# Altium schematic sheet RedBoard.SchDoc: Redboard Uno Clone
size B; Date: 1/7/2019 11:11:43 AM; Engineer: G. Lansberry; Organization: Wyss Institute at Harvard; Address1: 3 Blackfan Circle; Address2: Boston, MA 02115; Address3: USA; DocumentNumber: N/A; Revision: A; SheetNumber: 1; SheetTotal: 1
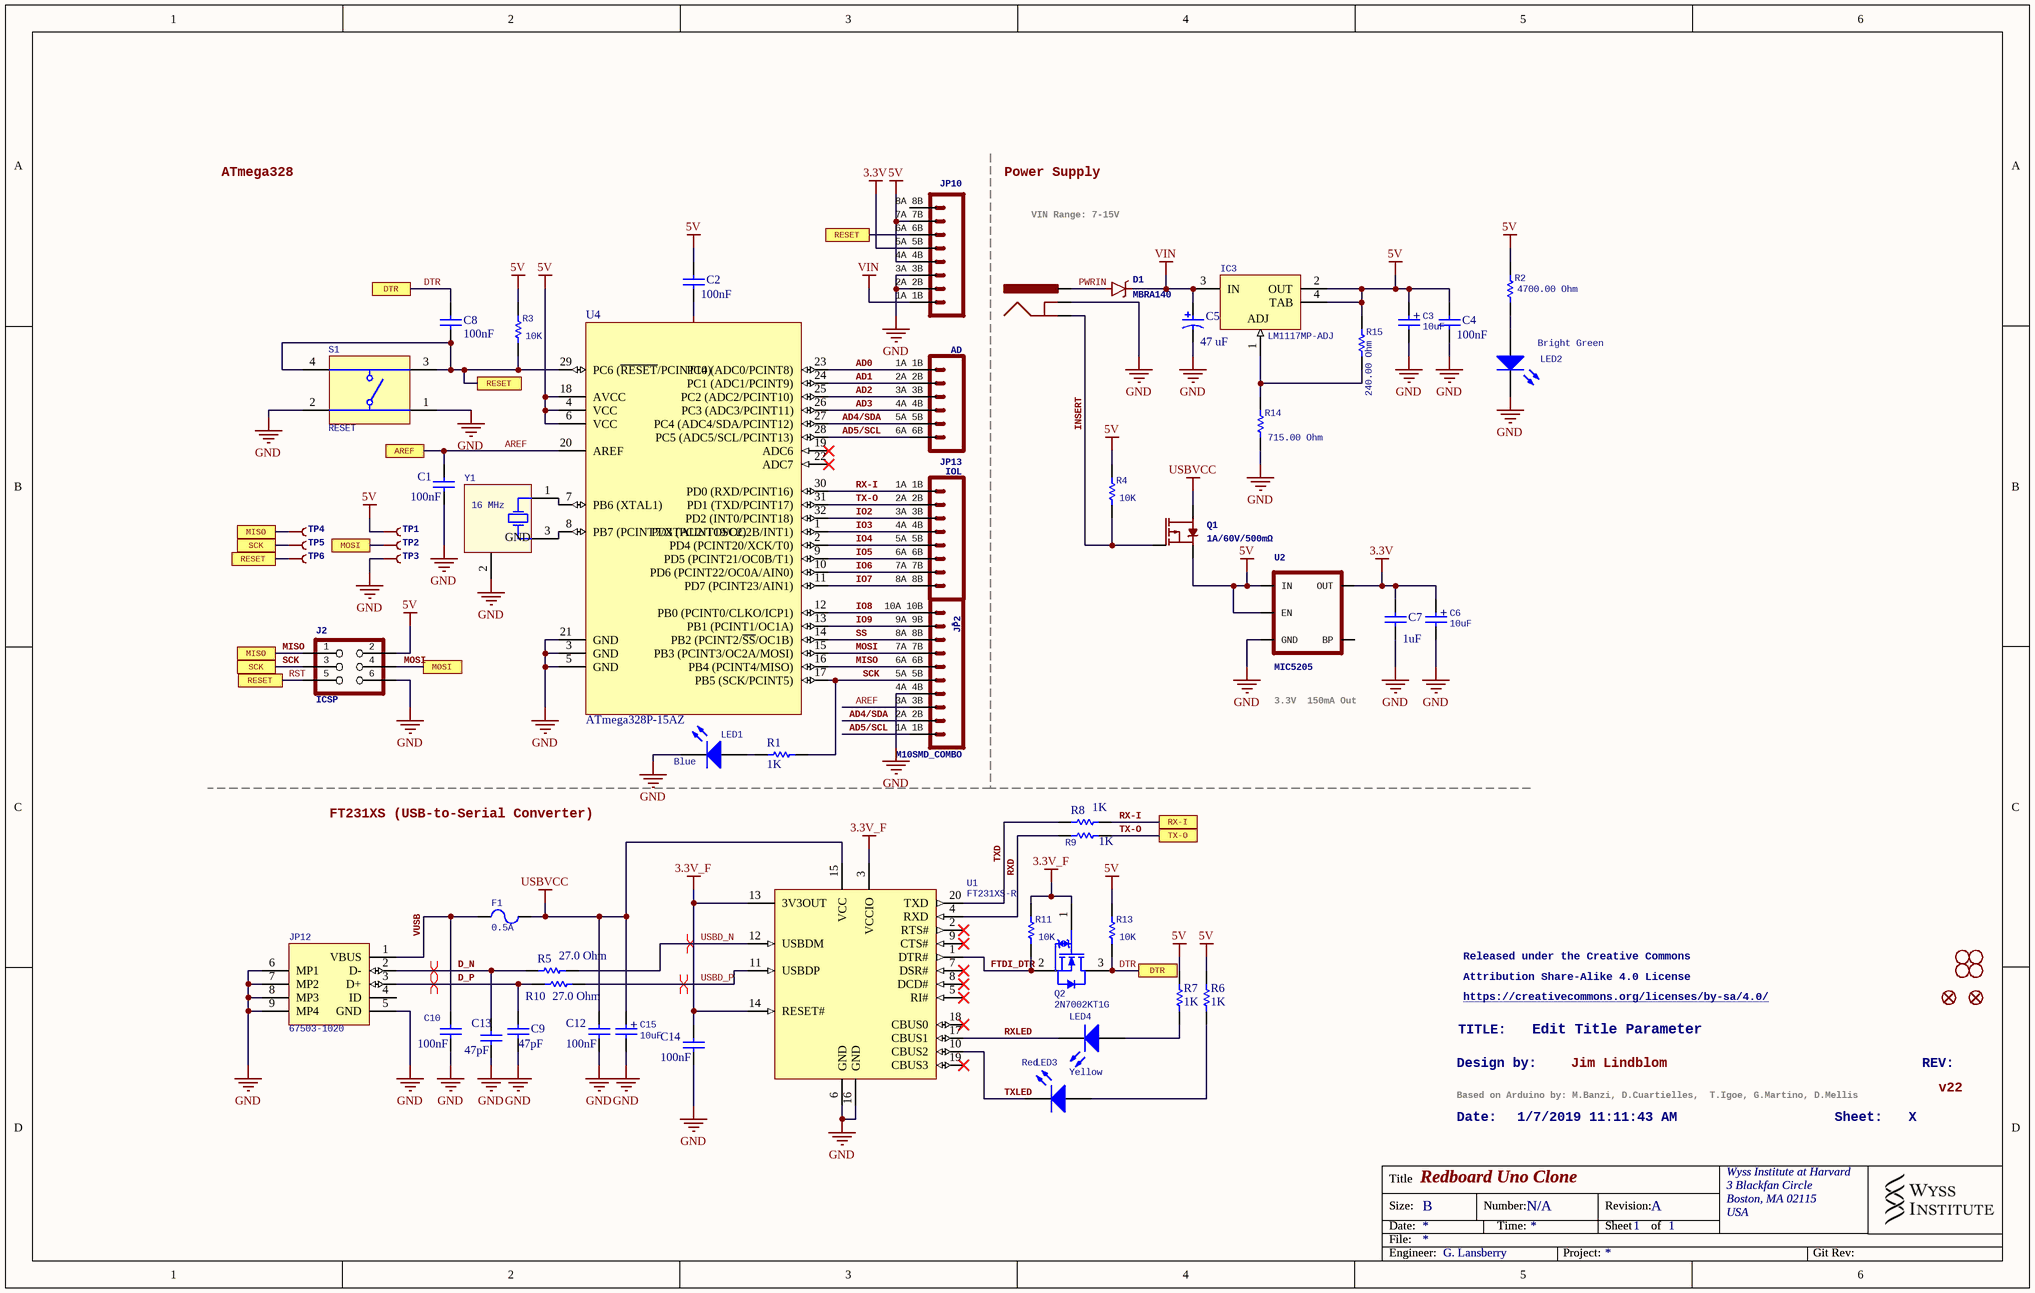
[diagram p0: RedBoard.SchDoc]

## Parts
C1  value 100nF  [CAPC0402(1005)60_M]  (hidden comment: CAP 100nF 10V 0402(1005))
C2  value 100nF  [CAPC0402(1005)60_M]  (hidden comment: CAP 100nF 10V 0402(1005))
C3  value 10uF  [CAPC2113X120X50NL20T30X]  (hidden comment: TAJP106M010RNJ)
C4  value 100nF  [CAPC0402(1005)60_M]  (hidden comment: CAP 100nF 10V 0402(1005))
C5  Cap.: 47 uF  [PNSC-FT-V-53x53-2_V]  (hidden comment: EEE-FT1E470AR)
C6  value 10uF  [CAPC2113X120X50NL20T30X]  (hidden comment: TAJP106M010RNJ)
C7  value 1uF  [CAPC0402(1005)60_N]  (hidden comment: CAP 1uF 10V 0402(1005))
C8  value 100nF  [CAPC0402(1005)60_M]  (hidden comment: CAP 100nF 10V 0402(1005))
C9  value 47pF  [CAPC0402(1005)60_M]  (hidden comment: CAP 47pF 10V 0402(1005))
C10  value 100nF  [CAPC0402(1005)60_M]  (hidden comment: CAP 100nF 10V 0402(1005))
C12  value 100nF  [CAPC0402(1005)60_M]  (hidden comment: CAP 100nF 10V 0402(1005))
C13  value 47pF  [CAPC0402(1005)60_M]  (hidden comment: CAP 47pF 10V 0402(1005))
C14  value 100nF  [CAPC0402(1005)60_M]  (hidden comment: CAP 100nF 10V 0402(1005))
C15  value 10uF  [CAPC2113X120X50NL20T30X]  (hidden comment: TAJP106M010RNJ)
D1  MBRA140  [ONSC-SMA-2-403D-02_V]
F1  0.5A  [LFUS-1812L050_V]
IC3  LM1117MP-ADJ  [DCY0004A_L]
J2  ICSP  [2X3_SMT_POSTS]
J3  POWER_JACKSUPER_BOMB_DIGITY  [POWER_JACK_SMD_OVERPASTE_SUPER_BOMB_DIGITY]  (value not drawn)
JP2  M10SMD_COMBO  [1X10_SMD_COMBINED]
JP3  STAND-OFF  [STAND-OFF]  (value not drawn)  (no BOM)
JP4  STAND-OFF  [STAND-OFF]  (value not drawn)  (no BOM)
JP5  STAND-OFF  [STAND-OFF]  (value not drawn)  (no BOM)
JP6  STAND-OFF  [STAND-OFF]  (value not drawn)  (no BOM)
JP8  FIDUCIAL1X2  [FID]  (value not drawn)  (no BOM)
JP9  FIDUCIAL1X2  [FID]  (value not drawn)  (no BOM)
JP10  M08SMD-COMBO  [1X08_SMD_COMBINED]  (value not drawn)
JP11  IOL  [1X08_SMD_COMBINED]
JP12  67503-1020  [MOLX-67503-1020_V]
JP13  AD  [1X06_SMD_STRAIGHT_COMBO]
LED1  Color: Blue  [0603_A]  (hidden comment: 150060BS75000)
LED2  Color: Bright Green  [0603_A]  (hidden comment: 150060VS75000)
LED3  Color: Red  [0603_A]  (hidden comment: 150060RS75000)
LED4  Color: Yellow  [0603_A]  (hidden comment: 150060YS75000)
Q1  1A/60V/500mΩ  [SOT23-3]
Q2  2N7002KT1G  [ONSC-SOT-23-3-318-08_V]
R1  value 1K  [RESC0402(1005)_L]  (hidden comment: 1K 1% 0402(1005))
R2  value 4700.00 Ohm  [RESC0402(1005)_N]  (hidden comment: 4K7 1% 0402(1005))
R3  value 10K  [RESC0402(1005)_N]  (hidden comment: 10K 1% 0402(1005))
R4  value 10K  [RESC0402(1005)_N]  (hidden comment: 10K 1% 0402(1005))
R5  value 27.0 Ohm  [RESC0402(1005)_M]  (hidden comment: 27R 1% 0402(1005))
R6  value 1K  [RESC0402(1005)_L]  (hidden comment: 1K 1% 0402(1005))
R7  value 1K  [RESC0402(1005)_L]  (hidden comment: 1K 1% 0402(1005))
R8  value 1K  [RESC0402(1005)_L]  (hidden comment: 1K 1% 0402(1005))
R9  value 1K  [RESC0402(1005)_L]  (hidden comment: 1K 1% 0402(1005))
R10  value 27.0 Ohm  [RESC0402(1005)_M]  (hidden comment: 27R 1% 0402(1005))
R11  value 10K  [RESC0402(1005)_N]  (hidden comment: 10K 1% 0402(1005))
R13  value 10K  [RESC0402(1005)_N]  (hidden comment: 10K 1% 0402(1005))
R14  value 715.00 Ohm  [RESC0402(1005)_M]  (hidden comment: 715R 1% 0402(1005))
R15  value 240.00 Ohm  [RESC0402(1005)_L]  (hidden comment: 240R 1% 0402(1005))
S1  RESET  [TECO-FSM4JSMATR_V]
TP1  TP-3x5  [PAD.03X.05]  (value not drawn)  (no BOM)
TP2  TP-3x5  [PAD.03X.05]  (value not drawn)  (no BOM)
TP3  TP-3x5  [PAD.03X.05]  (value not drawn)  (no BOM)
TP4  TP-3x5  [PAD.03X.05]  (value not drawn)  (no BOM)
TP5  TP-3x5  [PAD.03X.05]  (value not drawn)  (no BOM)
TP6  TP-3x5  [PAD.03X.05]  (value not drawn)  (no BOM)
U1  FT231XS-R  [SSOP-20_L]
U2  MIC5205  [SOT-23-5]
U4  ATmega328P-15AZ  [32MA_M]
Y1  Oscillating Frequency: 16 MHz  [MURA-CSTCE_V-3_V]  (hidden comment: CSTCE16M0V53-R0)

## Ports
AREF, DTR, MISO, MOSI, RESET, RX-I, SCK, TX-O

## Nets
3.3V: C6.1 C7.2 JP10.5A_5B U2.5(OUT)
3.3V_F: C14.2 Q2.1(G) R11.2 U1.3(VCCIO) U1.13(3V3OUT) U1.14(RESET#)
5V: C2.2 C3.1 C4.2 IC3.2(OUT) IC3.4(TAB) J2.2 JP10.4A_4B JP10.7A_7B Q1.2(S) R2.2 R3.2 R4.2 R6.1 R7.1 R13.2 R15.2 TP1.P$1 U2.1(IN) U2.3(EN) U4.4(VCC) U4.6(VCC) U4.18(AVCC)
GND: C1.1 C2.1 C3.2 C4.1 C5.2 C6.2 C7.1 C9.1 C10.1 C12.1 C13.1 C14.1 C15.2 J2.6 J3.GND(GNDBREAK) JP2.4A_4B JP10.2A_2B JP10.3A_3B JP12.5(GND) JP12.6(MP1) JP12.7(MP2) JP12.8(MP3) JP12.9(MP4) LED1.1(K) LED2.1(K) R14.1 S1.1 S1.2 TP3.P$1 U1.6(GND) U1.16(GND) U2.2(GND) U4.3(GND) U4.5(GND) U4.21(GND) Y1.2(GND)
USBVCC: C12.2 C15.1 F1.2 Q1.3(D) U1.15(VCC)
VIN: C5.1 D1.C IC3.3(IN) JP10.1A_1B
AD0: JP13.1A_1B U4.23(PC0_(ADC0/PCINT8))
AD1: JP13.2A_2B U4.24(PC1_(ADC1/PCINT9))
AD2: JP13.3A_3B U4.25(PC2_(ADC2/PCINT10))
AD3: JP13.4A_4B U4.26(PC3_(ADC3/PCINT11))
AD4/SDA: JP2.2A_2B JP13.5A_5B U4.27(PC4_(ADC4/SDA/PCINT12))
AD5/SCL: JP2.1A_1B JP13.6A_6B U4.28(PC5_(ADC5/SCL/PCINT13))
AREF: C1.2 JP2.3A_3B U4.20(AREF) ; port AREF
D_N: C13.2 JP12.2(D-) R5.1
D_P: C9.2 JP12.3(D+) R10.1
DTR: C8.1 Q2.3(D) R13.1 ; port DTR
FTDI_DTR: Q2.2(S) R11.1 U1.1(DTR#)
INSERT: J3.P$4(GND) Q1.1(G) R4.1
IO2: JP11.3A_3B U4.32(PD2_(INT0/PCINT18))
IO3: JP11.4A_4B U4.1(PD3_(PCINT19/OC2B/INT1))
IO4: JP11.5A_5B U4.2(PD4_(PCINT20/XCK/T0))
IO5: JP11.6A_6B U4.9(PD5_(PCINT21/OC0B/T1))
IO6: JP11.7A_7B U4.10(PD6_(PCINT22/OC0A/AIN0))
IO7: JP11.8A_8B U4.11(PD7_(PCINT23/AIN1))
IO8: JP2.10A_10B U4.12(PB0_(PCINT0/CLKO/ICP1))
IO9: JP2.9A_9B U4.13(PB1_(PCINT1/OC1A))
MISO: J2.1 JP2.6A_6B TP4.P$1 U4.16(PB4_(PCINT4/MISO)) ; port MISO
MOSI: J2.4 JP2.7A_7B TP2.P$1 U4.15(PB3_(PCINT3/OC2A/MOSI)) ; port MOSI
PWRIN: D1.A J3.VIN0(PWR)
RST: C8.2 J2.5 JP10.6A_6B R3.1 S1.3 S1.4 TP6.P$1 U4.29(PC6_(~{RESET}/PCINT14)) ; port RESET
RX-I: JP11.1A_1B R8.1 U4.30(PD0_(RXD/PCINT16)) ; port RX-I
RXD: R9.2 U1.4(RXD)
RXLED: LED4.1(K) U1.17(CBUS1)
SCK: J2.3 JP2.5A_5B R1.1 TP5.P$1 U4.17(PB5_(SCK/PCINT5)) ; port SCK
SS: JP2.8A_8B U4.14(PB2_(PCINT2/~{SS}/OC1B))
TX-O: JP11.2A_2B R9.1 U4.31(PD1_(TXD/PCINT17)) ; port TX-O
TXD: R8.2 U1.20(TXD)
TXLED: LED3.1(K) U1.10(CBUS2)
USBD_N: R5.2 U1.12(USBDM)
USBD_P: R10.2 U1.11(USBDP)
VUSB: C10.2 F1.1 JP12.1(VBUS)
NetIC3_1: IC3.1(ADJ) R14.2 R15.1
NetLED1_2: LED1.2(A) R1.2
NetLED2_2: LED2.2(A) R2.1
NetLED3_2: LED3.2(A) R6.2
NetLED4_2: LED4.2(A) R7.2
NetU4_7: U4.7(PB6_(XTAL1)) Y1.1(C1)
NetU4_8: U4.8(PB7_(PCINT7/XTAL2/TOSC2)) Y1.3(C2)

Not connected (* = marked no-connect by the designer): JP10 8A 8B(8); JP12 4(ID); U1 2(RTS#)* 5(RI#)* 7(DSR#)* 8(DCD#)* 9(CTS#)* 18(CBUS0)* 19(CBUS3)*; U2 4(BP); U4 19(ADC6)* 22(ADC7)*

## Layout directives
differential pair: D_N, D_P, USBD_N, USBD_P

## Notes on the sheet
- ATmega328
- Power Supply
- VIN Range: 7-15V
- 3.3V
  150mA Out
- FT231XS (USB-to-Serial Converter)
- Released under the Creative Commons
- TITLE:
- Attribution Share-Alike 4.0 License
- https://creativecommons.org/licenses/by-sa/4.0/
- Edit Title Parameter
- Based on Arduino by: M.Banzi, D.Cuartielles,
  T.Igoe, G.Martino, D.Mellis
- Design by:
- Jim Lindblom
- REV:
- v22
- Date:
- 1/7/2019 11:11:43 AM
- Sheet:
- X
- Title
- Size:
- File:
- B
- Number:
- Time:
- Revision:
- Sheet
- of
- Engineer:
- Project:
- Git Rev:
- (in symbol CAP_0603_TANT) +

## Library data of the parts
C1 C2 C4 C8 C10 C12 C14 = CMP-1034-02067-1: CAP 100nF 10V -20% to +80% 0402 (1005 Metric) Thickness 0.6mm SMD; Case-Metric: 1005; Case-EIA: 0402; Technology: SMT; Max Thickness: 0.6 mm; Rated Voltage: 10 V; Tolerance: -20% to +80%; Supplier 1: Digi-Key; Supplier Part Number 1: 478-1138-1-ND
C3 C6 C15 = CAP_0603_TANT: Manufacturer: AVX Interconnect / Elco; Part Number: TAJP106M010RNJ; Supplier 1: Digi-Key; Supplier Part Number 1: 478-3281-1-ND
C5 = CMP-0744-00003-1: Aluminum Electrolytic Capacitor, 47 uF +/- 20%, 25 V, -55 to 105 degC, 2-Pin 5.3 x 5.3 x 6.1 mm SMD, RoHS, Tape and Reel; Manufacturer: Panasonic; Ripple Current: 240 mA; Rated Voltage: 25 V; Capacitance Tolerance: +/- 20%; ComponentLink3Description: Package Specification; RoHS: TRUE; PackageReference: FT-V-53x53-2; PartNumber: EEE-FT1E470AR; DatasheetVersion: Mar-14; Temp. Range: -55 to 105 degC; ComponentLink2URL: http://industrial.panasonic.com/www-data/pdf/ABA0000/ABA0000CE135.pdf; PackageDescription: 2-Pin SMD, Body 5.3 x 5.3 mm, Height 6.1 mm; ComponentLink3URL: http://industrial.panasonic.com/www-data/pdf/ABA0000/ABA0000PE248.pdf; Mounting Technology: Surface Mount; ComponentLink2Description: Datasheet; ComponentLink1URL: http://www.panasonic.com/industrial/electronic-components/; PackageVersion: Feb-14; Packing: Tape and Reel; ComponentLink1Description: Manufacturer URL
C7 = CMP-1034-02118-1: CAP 1uF 10V -20% to +80% 0402 (1005 Metric) Thickness 0.6mm SMD; Case-EIA: 0402; Case-Metric: 1005; Tolerance: -20% to +80%; Max Thickness: 0.6 mm; Rated Voltage: 10 V; Technology: SMT
C9 C13 = CMP-1034-01073-1: CAP 47pF 10V ±1% 0402 (1005 Metric) Thickness 0.6mm SMD; Tolerance: Â±1%; Case-Metric: 1005; Case-EIA: 0402; Max Thickness: 0.6 mm; Technology: SMT; Rated Voltage: 10 V
D1 = MBRA140: 40V, 1A Schottky rectifierSMA/DO-214AC packageDIO-08053; Manufacturer: ON Semiconductor; Manufacturer Part Number: MBRA140T3G; GateName_1: G$1; SymbolName_1: DIODE-SCHOTTKY; Element Configuration: Single; Forward Voltage: 550mV; Max Forward Surge Current (Ifsm): 30A; Peak Reverse Current: 500uA; Polarity: Standard; LibraryName: SparkFun-DiscreteSemi; DeviceSetName: MBRA140; PROD_ID: DIO-08053; Supplier 1: Digi-Key; Supplier Part Number 1: MBRA140T3GOSCT-ND; RoHS: Yes; Stock 1: 44999; Pricing 1: 1 = 0.46000, 10 = 0.34800, 100 = 0.21660, 500 = 0.14818, 1000 = 0.11398 (USD); Case/Package: SMA; Number of Pins: 2; Weight: 0.01lb; Contact Plating: Matte,Tin; Min Operating Temperature: -55°C; Max Operating Temperature: 125°C; Packaging: Tape and Reel; Average Rectified Current: 1A; Max Reverse Voltage (DC): 40V; Package Quantity: 1; Max Surge Current: 30A; Forward Current: 1A; Max Reverse Leakage Current: 500uA; Max Repetitive Reverse Voltage (Vrrm): 40V; Peak Non-Repetitive Surge Current: 30A; Voltage Rating (DC): 40V; Current Rating: 1A; Output Current: 1A; Termination: SMD/SMT; Length: 4.32mm; Height: 2mm; Width: 2.6mm; Radiation Hardening: No; Lead Free: Lead Free; REACH SVHC: No SVHC; Halogen Free: Halogen Free; ComponentLink1URL: http://www.farnell.com/datasheets/2353770.pdf; ComponentLink1Description: http://www.farnell.com/datasheets/2353770.pdf; ComponentLink2URL: http://www.onsemi.com/pub/Collateral/MBRA140T3-D.PDF; ComponentLink2Description: http://www.onsemi.com/pub/Collateral/MBRA140T3-D.PDF; ComponentLink3URL: http://www.jameco.com/Jameco/Products/ProdDS/925556.pdf; ComponentLink3Description: http://www.jameco.com/Jameco/Products/ProdDS/925556.pdf; ComponentLink4URL: http://www.mouser.com/ds/2/308/MBRA140T3-D-92888.pdf; ComponentLink4Description: http://www.mouser.com/ds/2/308/MBRA140T3-D-92888.pdf
F1 = CMP-1700-00002-1: POLY-FUSE(R) Resettable PTC, 0.5 A, 0.15 to 1 Ohm Resistance, -40 to 85 degC, 1812 (4532 Metric), RoHS, Tape and Reel; Voltage Rating: 50 V; Power Rating: 100 mW; Resistance: 150 kohm; Tolerance: 1%; Case\Package: 0603; ComponentLink2URL: http://www.littelfuse.com/~/media/electronics/datasheets/resettable_ptcs/littelfuse_ptc_1812l_datasheet.pdf.pdf; Pins: 2; Mount: Surface Mount; Width: 0.8 mm; Length: 1.6 mm; Package Quantity: 1; Max Operating Temperature: 155 degC; Case Code (Imperial): 0603; ComponentLink1Description: Manufacturer URL; PackageReference: 1812; ComponentLink1URL: http://www.littelfuse.com/; RoHSCompliant: true; Voltage Rating (DC): 50 V; Packaging: Tape and Reel; PackageDescription: 2-Pin Surface Mount Device, Body 4.55 x 3.24 mm; Min Operating Temperature: -55 degC; DatasheetVersion: Feb-16; REACH SVHC: No SVHC; Case Code (Metric): 1608; ComponentLink2Description: Datasheet; Height: 0.45 mm; Supplier 1: Digi-Key; Supplier Part Number 1: F2150CT-ND
IC3 = CMP-0062-01643-4: 800mA Low-Dropout Linear Regulator, 4-pin SOT-223, Pb-Free; PartNumber: LM1117MP-ADJ/NOPB; Manufacturer: Texas Instruments; CompType: LDO IC; PackageTopMarking: XYTT*N03A; High-Reliability: Y; PowerWise: N; ComponentLink1URL: http://www.ti.com/general/docs/lit/getliterature.tsp?genericPartNumber=LM1117-N&fileType=pdf; Code_JEDEC: TO-261-AA; ComponentLink1Description: Datasheet URL; PinCount: 4; Code_IPC: SOT223-4; RoHS: Y; PackageReference: DCY0004A; PackageDescription: Molded SOT-223, 6.50 x 3.56 x 1.6mm Body, 4 Lead, 2.3mm Pitch; Supplier 1: Digi-Key; Supplier Part Number 1: LM1117MP-ADJ/NOPBCT-ND
J2 = AVR_SPI_PROG_3X2SMD: AVR ISP 6 PinThis is the reduced ISP connector for AVR programming. Common on Arduino. This footprint will take up less PCB space and can be used with a 10-pin to 6-pin adapter such as SKU: BOB-08508 **Special note about "TEST_POINT" package. The stop mask is on the top side, so if you want your programming test points to be on the bottom of your board, make sure to place this package on the bottom side of the board. This also ensure that the orientation to program from the bottom side will be correct.; GateName_1: G$1; SymbolName_1: AVR_SPI_PROGRAMMER_6; DeviceName: SMD; PROD_ID: CONN-11415; LibraryName: SparkFun-Connectors; DeviceSetName: AVR_SPI_PROG_3X2
J3 = POWER_JACKSUPER_BOMB_DIGITY: Power JackThis is the standard 5.5mm barrel jack for power. The PTH is the most common, proven, reliable, footprint. All others are experimental. The Slot footprint only works if the mill layer is transmitted to the PCB fab house so be warned. Spark Fun Electronics SKU : PRT-00119. Mating wall wart : TOL-00298 (and others); GateName_1: G$1; PROD_ID: CONN-08106; SymbolName_1: POWERJACK; DeviceName: SUPER_BOMB_DIGITY; LibraryName: Testing; DeviceSetName: POWER_JACK
JP2 = M10SMD_COMBO: Header 10Standard 10-pin 0.1" header. Use with straight break away headers (SKU : PRT-00116), right angle break away headers (PRT-00553), swiss pins (PRT-00743), machine pins (PRT-00117), and female headers (PRT-00115).; GateName_1: G$1; SymbolName_1: M10; PROD_ID: CONN-11219; DeviceName: SMD_COMBO; LibraryName: SparkFun-Connectors; DeviceSetName: M10; NAME: *
JP3-JP6 = STAND-OFF: Stand OffThis is the mechanical footprint for a #4 phillips button head screw. Use the keepout ring to avoid running the screw head into surrounding components. SKU : PRT-00447; GateName_1: G$1; SymbolName_1: STAND-OFF; LibraryName: SparkFun; DeviceSetName: STAND-OFF
JP8 JP9 = FIDUCIAL1X2: Fiducial Alignment PointsVarious fiducial points for machine vision alignment.; GateName_1: G$1; DeviceName: 1X2; SymbolName_1: FIDUCIAL; LibraryName: SparkFun; DeviceSetName: FIDUCIAL
JP10 JP11 = M08SMD-COMBO: Header 8Standard 8-pin 0.1" header. Use with straight break away headers (SKU : PRT-00116), right angle break away headers (PRT-00553), swiss pins (PRT-00743), machine pins (PRT-00117), and female headers (PRT-00115).; GateName_1: G$1; SymbolName_1: M08; PROD_ID: CONN-10204; DeviceName: SMD-COMBO; LibraryName: SparkFun-Connectors; DeviceSetName: M08
JP12 = CMP-0411-00002-1: USB, MINI, SMD, RA KME04-USBMU03A01; Manufacturer: Molex; ComponentLink1URL: http://www.molex.com/; PartNumber: 67503-1020; Mounting Technology: Surface Mount; ComponentLink1Description: Manufacturer URL; Terminal Pitch: 0.8 mm; DatasheetVersion: Rev F, 06/2009; ComponentLink2Description: Datasheet; PackageDescription: Mini USB Connector, SMT, Righer Angle; ComponentLink2URL: http://www.molex.com/pdm_docs/sd/675031020_sd.pdf; PackageReference: 67503-1020
JP13 = M06SMD-STRAIGHT-COMBO: Header 6Standard 6-pin 0.1" header. Use with straight break away headers (SKU : PRT-00116), right angle break away headers (PRT-00553), swiss pins (PRT-00743), machine pins (PRT-00117), and female headers (PRT-00115). Molex polarized connector foot print use with SKU : PRT-08094 with associated crimp pins and housings.NOTES ON THE VARIANTS LOCK and LOCK_LONGPADS... This footprint was designed to help hold the alignment of a through-hole component (i.e.  6-pin header) while soldering it into place. You may notice that each hole has been shifted either up or down by 0.005 of an inch from it's more standard position (which is a perfectly straight line).  This slight alteration caused the pins (the squares in the middle) to touch the edges of the holes.  Because they are alternating, it causes a "brace" to hold the component in place.  0.005 has proven to be the perfect amount of "off-center" position when using our standard breakaway headers. Although looks a little odd when you look at the bare footprint, once you have a header in there, the alteration is very hard to notice.  Also,if you push a header all the way into place, it is covered up entirely on the bottom side.  This idea of altering the position of holes to aid alignment will be further integrated into the Sparkfun Library for other footprints.  It can help hold any component with 3 or more connection pins.; GateName_1: G$1; SymbolName_1: M06; PROD_ID: CONN-10203; DeviceName: SMD-STRAIGHT-COMBO; LibraryName: SparkFun-Connectors; DeviceSetName: M06
LED1 = CMP-1426-00003-1: SMD mono-color Chip LED, WL-SMCW, Blue; Manufacturer: Wuerth Elektronik; ComponentLink2Description: Datasheet; ComponentLink2URL: http://katalog.we-online.com/led/datasheet/150060BS75000.pdf; ComponentLink1URL: http://www.we-online.com; PackageReference: 0603_A; PartNumber: 150060BS75000; ComponentLink1Description: Manufacturer URL
LED2 = CMP-1426-00006-1: SMD mono-color Chip LED, WL-SMCW, Bright Green; Manufacturer: Wuerth Elektronik; ComponentLink2URL: http://katalog.we-online.com/led/datasheet/150060VS75000.pdf; ComponentLink1Description: Manufacturer URL; PackageReference: 0603_A; PartNumber: 150060VS75000; ComponentLink2Description: Datasheet; ComponentLink1URL: http://www.we-online.com
LED3 = CMP-1426-00001-1: SMD mono-color Chip LED, WL-SMCW, Red; Manufacturer: Wuerth Elektronik; PackageReference: 0603_A; ComponentLink2URL: http://katalog.we-online.com/led/datasheet/150060RS75000.pdf; ComponentLink1URL: http://www.we-online.com; ComponentLink1Description: Manufacturer URL; ComponentLink2Description: Datasheet; PartNumber: 150060RS75000
LED4 = CMP-1426-00005-1: SMD mono-color Chip LED, WL-SMCW, Yellow; Manufacturer: Wuerth Elektronik; ComponentLink1URL: http://www.we-online.com; PartNumber: 150060YS75000; ComponentLink2Description: Datasheet; ComponentLink2URL: http://katalog.we-online.com/led/datasheet/150060YS75000.pdf; ComponentLink1Description: Manufacturer URL; PackageReference: 0603_A
Q1 = MOSFET-PCH-ZXMP6A13F: P-channel MOSFETsVoltage controlled devices that allow control of high current outputs.; Manufacturer: Diodes Zetex; Manufacturer Part Number: ZXMP6A13FTA; GateName_1: G$1; SymbolName_1: LABELED-PMOS; PROD_ID: TRANS-08285; Gate to Source Voltage (Vgs): 20V; Continuous Drain Current (ID): 1.1A; Input Capacitance: 219pF; Number of Elements: 1; Max Power Dissipation: 625mW; Rise Time: 2.2ns; Rds On Max: 400mR; Fall Time: 5.7ns; Turn-Off Delay Time: 11.2ns; Turn-On Delay Time: 1.6ns; Drain to Source Voltage (Vdss): -60V; Power Dissipation: 806mW; Drain to Source Resistance: 600mR; Threshold Voltage: -3V; Element Configuration: Single; Current Rating: -1.1A; DeviceName: -ZXMP6A13F; LibraryName: SparkFun-DiscreteSemi; DeviceSetName: MOSFET-PCH; Supplier 1: Digi-Key; Supplier Part Number 1: ZXMP6A13FCT-ND; RoHS: Yes; Stock 1: 386289; Pricing 1: 1 = 0.65000, 10 = 0.54400, 100 = 0.40790, 500 = 0.29912, 1000 = 0.23113 (USD); Mount: Surface Mount; Case/Package: SOT-23; Number of Pins: 3; Weight: 0.000282oz; Contact Plating: Matte,Tin; Min Operating Temperature: -55°C; Max Operating Temperature: 150°C; Packaging: Tape and Reel; Package Quantity: 3000; Number of Channels: 1; On-State Resistance: 600mR; Voltage Rating (DC): -60V; Length: 3.04mm; Height: 1.02mm; Width: 1.4mm; Radiation Hardening: No; REACH SVHC: No SVHC; Lead Free: Lead Free; ComponentLink1URL: http://www.farnell.com/datasheets/1915640.pdf; ComponentLink1Description: http://www.farnell.com/datasheets/1915640.pdf; ComponentLink2URL: http://docs-europe.electrocomponents.com/webdocs/0d2e/0900766b80d2efb2.pdf; ComponentLink2Description: http://docs-europe.electrocomponents.com/webdocs/0d2e/0900766b80d2efb2.pdf; ComponentLink3URL: http://www.diodes.com/datasheets/ZXMP6A13F.pdf; ComponentLink3Description: http://www.diodes.com/datasheets/ZXMP6A13F.pdf; ComponentLink4URL: http://www.mouser.com/ds/2/115/ZXMP6A13F-77652.pdf; ComponentLink4Description: http://www.mouser.com/ds/2/115/ZXMP6A13F-77652.pdf
Q2 = CMP-1058-00766-1: Small Signal MOSFET, 60 V, 380 mA, Single, N-Channel, 3-Pin SOT-23, Pb-Free, Tape and Reel; Manufacturer: On Semiconductor; Crss Typ (pF): 2.2; ID Max (A): 0.38; VGS(th) Max (V): 2.3; V(BR)DSS Min (V): 60; Coss Typ (pF): 4.2; Ciss Typ (pF): 24.5; Channel Polarity: N Channel; VGS Max (V): 20; RoHS: Pb-Free; PackageDescription: 3-Pin Small Outline Transistor, Body 2.92 x 1.3 mm, Pitch 0.95 mm; PackageVersion: Rev. AP, 11/2009; ComponentLink3URL: http://www.onsemi.cn/pub_link/Collateral/318-08.PDF; DatasheetVersion: Rev. 11; ComponentLink1URL: http://www.onsemi.com/; Configuration: Single; PackageReference: SOT-23-3-318-08; Mounting Technology: Surface Mount; Package Type: SOT-23-3; PartNumber: 2N7002KT1G; ComponentLink2Description: Datasheet; Packing: Tape and Reel; ComponentLink3Description: Package Specification; ComponentLink2URL: http://www.onsemi.com/pub_link/Collateral/2N7002K-D.PDF; ComponentLink1Description: Manufacturer URL
R1 R6-R9 = CMP-1011-00510-1: 1K 0.063W 1% 0402 (1005 Metric)  SMD; Case-EIA: 0402; Case-Metric: 1005; Technology: SMT; Tolerance: 1 %; Power: 0.063 W; Supplier 1: Digi-Key; Supplier Part Number 1: P47.0KLCT-ND
R2 = CMP-1011-00586-1: 4K7 0.063W 1% 0402 (1005 Metric)  SMD; Case-Metric: 1005; Case-EIA: 0402; Power: 0.063 W; Technology: SMT; Tolerance: 1 %; Supplier 1: Digi-Key; Supplier Part Number 1: 541-4.70KLCT-ND
R3 R4 R11 R13 = CMP-1011-00623-1: 10K 0.063W 1% 0402 (1005 Metric)  SMD; Case-Metric: 1005; Case-EIA: 0402; Tolerance: 1 %; Technology: SMT; Power: 0.063 W; Supplier 1: Digi-Key; Supplier Part Number 1: P12.0KLCT-ND
R5 R10 = CMP-1011-00331-1: 27R 0.063W 1% 0402 (1005 Metric)  SMD; Case-EIA: 0402; Case-Metric: 1005; Technology: SMT; Power: 0.063 W; Tolerance: 1 %; Supplier 1: Digi-Key; Supplier Part Number 1: P27.0LCT-ND
R14 = CMP-1011-00494-1: 715R 0.063W 1% 0402 (1005 Metric)  SMD; Case-EIA: 0402; Case-Metric: 1005; Power: 0.063 W; Technology: SMT; Tolerance: 1 %; Supplier 1: Digi-Key; Supplier Part Number 1: P715LCT-ND
R15 = CMP-1011-00438-1: 240R 0.063W 1% 0402 (1005 Metric)  SMD; Case-Metric: 1005; Case-EIA: 0402; Power: 0.063 W; Tolerance: 1 %; Technology: SMT
S1 = CMP-2000-07486-1: Micro Miniature Push Button Switch FSM JSM, 50 mA, -35 to 85 degC, 4-Pin SMD, RoHS, Tape and Reel; Manufacturer: TE Connectivity; Mechanical Life: 100000Cycles; Current Rating: 50mA; Actuator Material: Polyamide; Max Voltage Rating (DC): 12V; Capacitance: 0f; Illumination Type: Illuminated; Voltage Rating (DC): 24V; Case\/Package: SMD/SMT; Operating Force: 160gf; Contact Resistance: 100mOhm; Actuator Length: 0.055inch; Switch Travel: 0.25mm; Throw Configuration: SPST; Termination: GullWing; Contact Plating: Silver; Orientation: Straight; Mounting Technology: SurfaceMount; REACH SVHC: Unknown; Electrical Life: 100000Cycles; Package Reference: FSM4JSMATR; Max Operating Temperature: 85degC; Manufacturer URL: http://www.te.com/; Package Description: 4-Pin Surface Mount Device, Body 6 x 6 mm, Pitch 4.5 mm; Datasheet Version: Rev. V, 02/2015; Packaging: TapeandReel; Min Operating Temperature: -35degC; Mount: SurfaceMount; Contact Current Rating: 50mA; Contact Material: CopperAlloy; Package Quantity: 1200; Datasheet URL: http://www.te.com/commerce/DocumentDelivery/DDEController?Action=showdoc&DocId=Customer+Drawing%7F2-1437565-7%7FV%7Fpdf%7FEnglish%7FENG_CD_2-1437565-7_V.pdf%7F4-1437565-2; RoHSCompliant: true; Supplier 1: Digi-Key; Supplier Part Number 1: 450-1759-1-ND
TP1-TP6 = TEST-POINT3X5: Bare copper test points for troubleshooting or ICT; GateName_1: G$1; DeviceName: 3X5; SymbolName_1: TEST-POINT; DeviceSetName: TEST-POINT; NAME: TEST-POINT3X5
  TP1-TP4 TP6: LibraryName: SparkFun-Connectors
  TP5: LibraryName: SparkFun-Passives
U1 = CMP-0248-00024-2: USB to Full-Handshake UART Interface Chip, UHCI/OHCI/EHCI Compatible, USB 2.0 Compatible, -40 to +85 degC, 20-Pin SSOP, Pb-Free, Tape and Reel; Manufacturer: FTDI; PackageVersion: Feb-13; PackageReference: SSOP-20; ComponentLink1Description: Manufacturer URL; ComponentLink2Description: Datasheet; PackageDescription: 20-Pin Small Outline Package, 8.6 x 3.9 mm Body, 0.635 mm Pitch; ComponentLink3URL: www.ftdichip.com/Products/ICs/FT231X.html; PartNumber: FT231XS-R; DatasheetVersion: ver 1.2, Feb-2013; ComponentLink2URL: http://www.ftdichip.com/Support/Documents/DataSheets/ICs/DS_FT231X.pdf; Code_JEDEC: MO-137-AD; ComponentLink3Description: FT231X Product Page; RevisionNote: DatasheetVersion updated to 1.2 Feb-2013; ComponentLink1URL: http://www.ftdichip.com/
U2 = MIC52053.3V: MIC5205 150mA vreg3.3V - VREG-008225V - VREG-00823; Manufacturer: Microchip Micrel; Manufacturer Part Number: MIC5205-3.3YM5-TR; GateName_1: G$1; SymbolName_1: V-REG-LDO; DeviceName: 3.3V; Number of Regulators: 1; Dropout Voltage: 165mV; Min Input Voltage: 2.5V; Max Input Voltage: 16V; Output Type: Fixed; Polarity: Positive; Accuracy: 1%; Power Supply Rejection Ratio (PSRR): 75dB; LibraryName: SparkFun-PowerIC; DeviceSetName: MIC5205; PROD_ID: VREG-00822; Supplier 1: Digi-Key; Supplier Part Number 1: 576-1259-1-ND; RoHS: Yes; Stock 1: 6342; Pricing 1: 1 = 0.41000, 25 = 0.34000, 100 = 0.30900 (USD); Mount: Surface Mount; Case/Package: SOT-23; Number of Pins: 5; Min Operating Temperature: -40°C; Max Operating Temperature: 125°C; Output Voltage: 3.3V; Output Current: 150mA; Packaging: Tape and Reel; Package Quantity: 1; Number of Outputs: 1; Max Output Current: 150mA; Min Output Voltage: 3.3V; Output Voltage Accuracy: 1%; Nominal Output Voltage: 3.3V; Max Output Voltage: 3.3V; Max Supply Voltage: 16V; Min Supply Voltage: 2.5V; Termination: SMD/SMT; Length: 2.9mm; Height: 1.1mm; Width: 1.6mm; Radiation Hardening: No; REACH SVHC: No SVHC; ComponentLink1URL: http://www.farnell.com/datasheets/29605.pdf; ComponentLink1Description: http://www.farnell.com/datasheets/29605.pdf
U4 = CMP-0096-00111-2: 8-bit Automotive AVR Microcontroller, 32KB Flash, 1KB EEPROM, 2KB SRAM, 23 GPIO pins, Automotive Grade (-40°C to +125°C), 32-Pin TQFP; Manufacturer: Microchip / Atmel; Manufacturer Part Number: ATMEGA328P-AUR; Frequency: 20MHz; Interface: 2-Wire,I2C,SPI,UART,USART; Number of I/Os: 23; Oscillator Type: Internal; Peripherals: Brown-out Detect/Reset,POR,PWM,WDT; Min Supply Voltage: 1.8V; Max Supply Voltage: 5.5V; Number of Timers/Counters: 3; Data Bus Width: 8b; Watchdog Timer: Yes; ComponentLink2URL: http://www.atmel.com/dyn/resources/prod_documents/doc7810.pdf; PackageDescription: 32-Lead Thin Profile Plastic Quad Flatpack (TQFP) - 7x7x1mm Body,  0.8 mm Pitch; PackageVersion: revB, Jul-2007; ComponentLink2Description: ATmega328P Datasheet; ComponentLink1Description: Manufacturer URL; DatasheetVersion: revA, Nov-2009; RevisionNote: URLs added; ComponentLink1URL: http://www.atmel.com/; PackageReference: 32MA; RoHS: Yes; Stock 2: 33207; Pricing 2: 1 = 2.14000, 25 = 1.96720, 100 = 1.78190 (USD); Mount: Surface Mount; Case/Package: A; Number of Pins: 32; Contact Plating: Matte,Tin; Min Operating Temperature: -40°C; Max Operating Temperature: 85°C; Packaging: Tape and Reel; Memory Type: FLASH; Memory Size: 32KB; Core Architecture: AVR; RAM Size: 2KB; Package Quantity: 2000; Number of Programmable I/O: 23; Max Frequency: 20MHz; REACH SVHC: No SVHC; Lead Free: Lead Free; Supplier 1: Digi-Key; Supplier Part Number 1: ATMEGA328P-AURCT-ND
Y1 = CMP-0588-00001-2: Ceramic Resonator, 16 MHz with Built-in Capacitance, Thickness Expander Mode, Initial Frequency Tolerance +/- 0.5%, Load Capacity 15 pF, -20 to 80 degC, 3.2 x 1.3 x 1 mm SMD, RoHS, Reel; Manufacturer: Murata; Manufacturer Part Number: CSTNE16M0V530000R0; Load Capacity: 15 pF; PackageDescription: 3-Pin SMD, Body 3.2 x 1.3 mm, Pitch 0.95 mm; Mounting Technology: Surface Mount; ComponentLink1URL: http://www.murata.com/; RoHS: TRUE; Packing: Reel; Initial Frequency Tolerance: +/- 0.5%; PartNumber: CSTCE16M0V53-R0; ComponentLink2Description: Datasheet; DatasheetVersion: Rev. P16E-22; PackageReference: CSTCE_V-3; Operating Temperature Range: -20 to 80 degC; ComponentLink2URL: http://www.murata.com/products/catalog/pdf/p16e.pdf; ComponentLink1Description: Manufacturer URL; Initial Tolerance: +/- 0.5%; Supplier 1: Digi-Key; Supplier Part Number 1: 490-17948-1-ND; Stock 1: 11824; Pricing 1: 1 = 0.29000, 10 = 0.24300, 50 = 0.21860, 100 = 0.19430, 500 = 0.18454, 1000 = 0.15541 (USD)